# Altium schematic sheet Sheet2.SchDoc
size A3; SheetNumber: 1; SheetTotal: 1
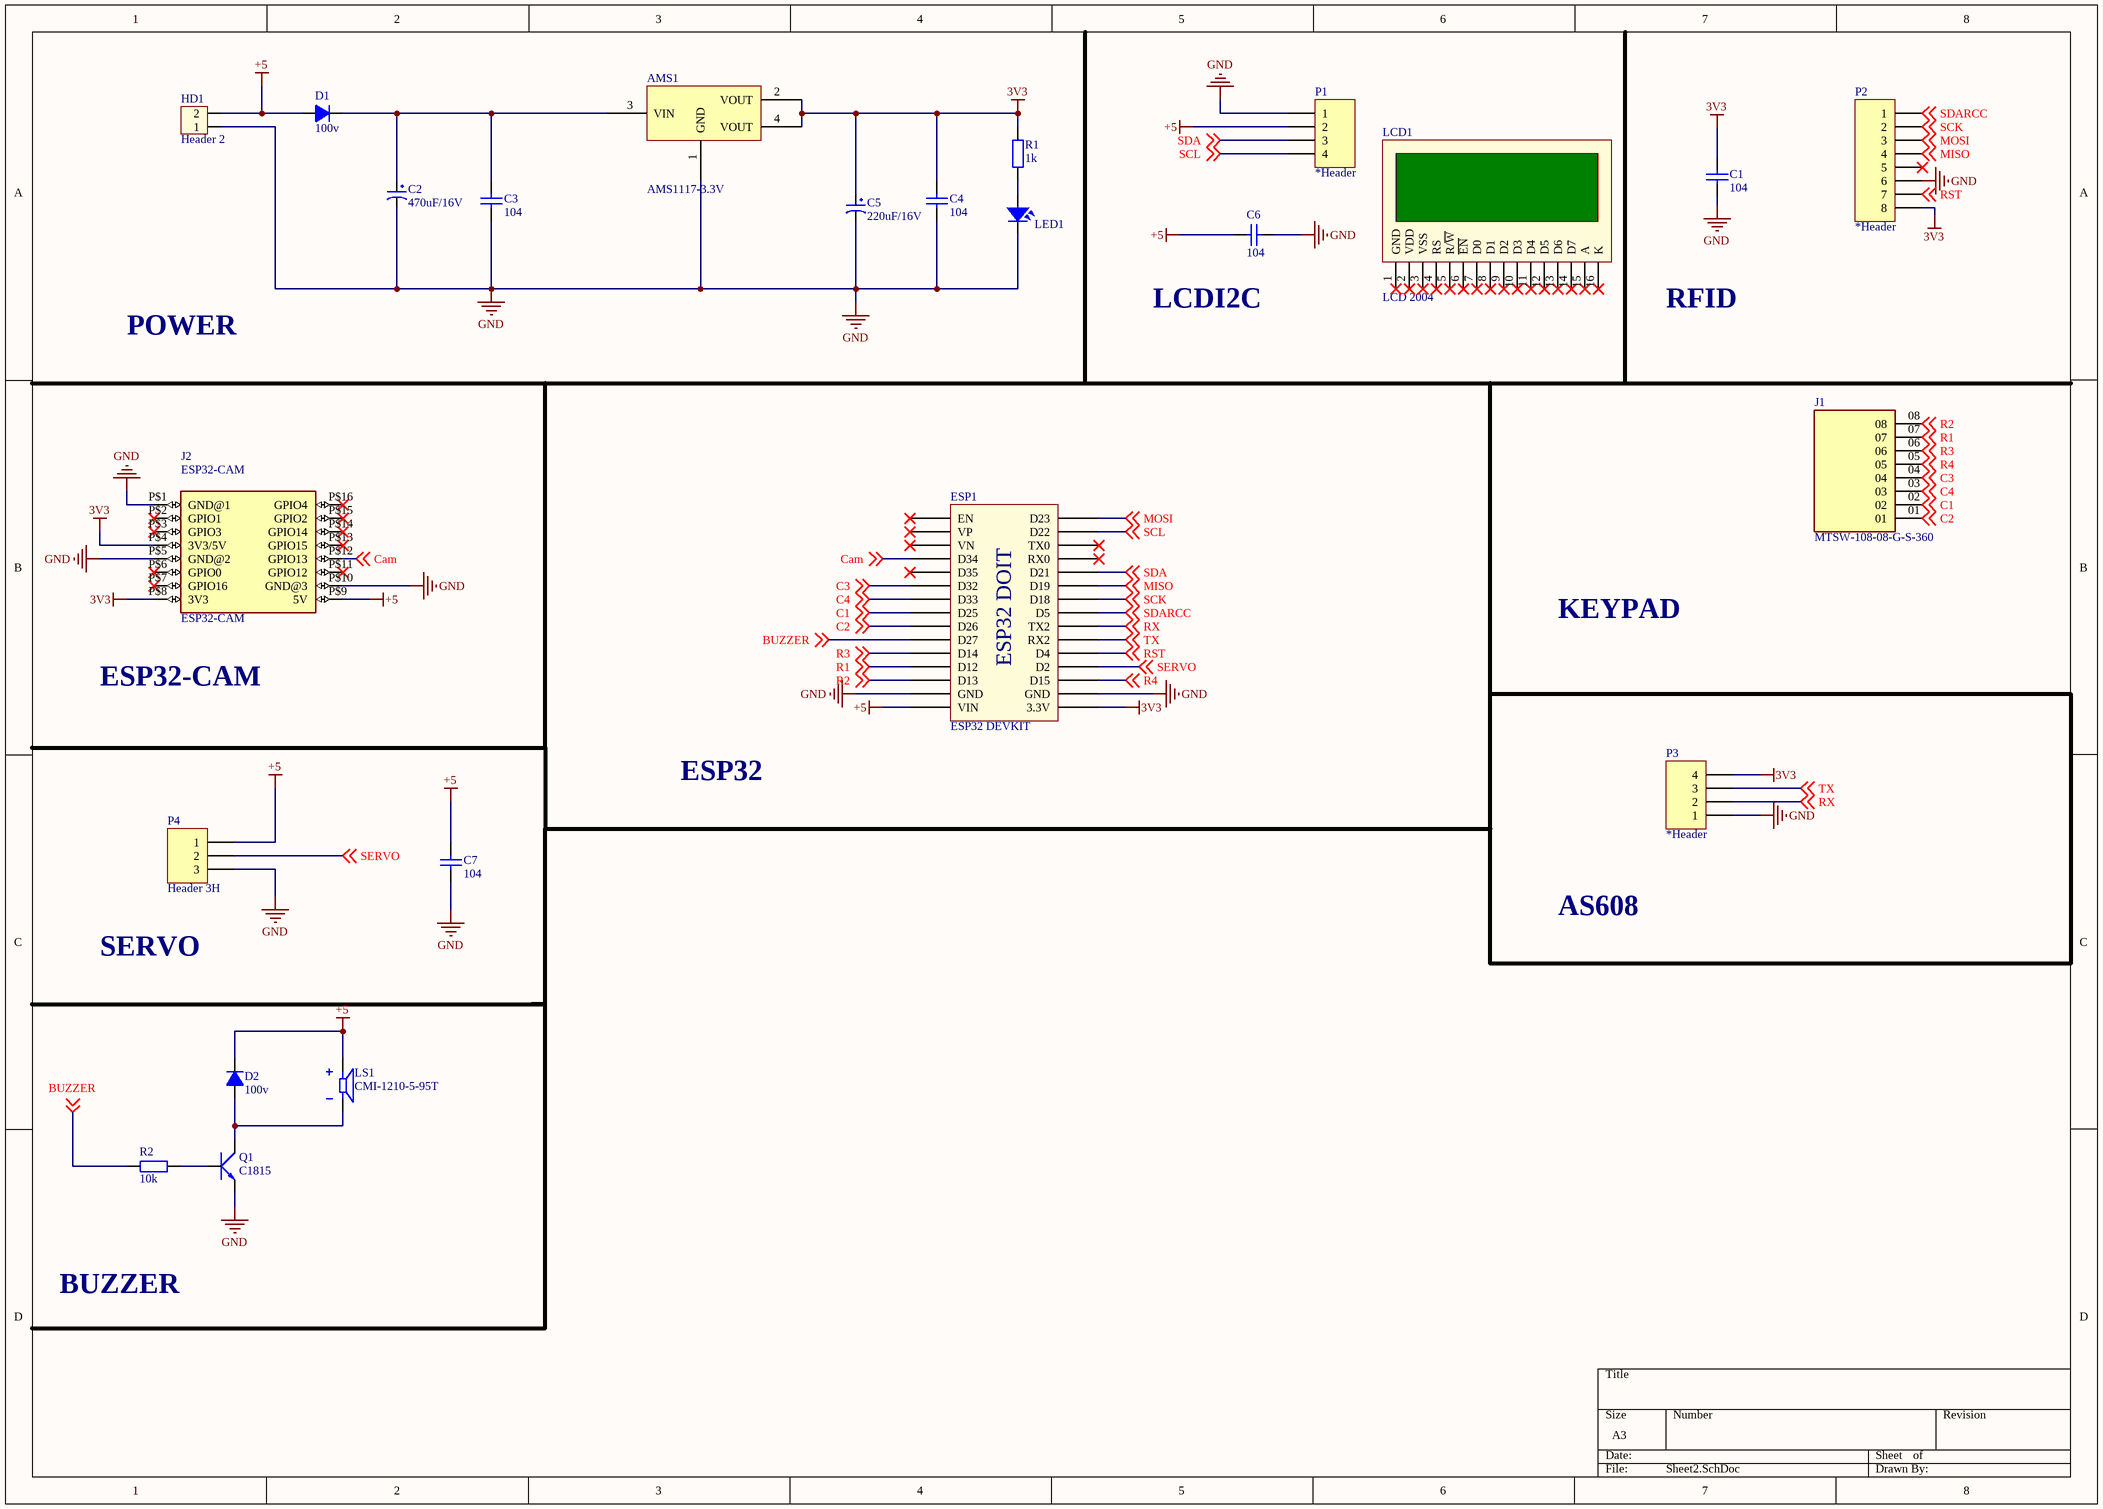
[diagram p0: Sheet2.SchDoc]

## Parts
AMS1  AMS1117-3.3V  [SOT223]
C1  104  [tu gom]
C2  470uF/16V  [CP1/2]
C3  104  [tu gom]
C4  104  [tu gom]
C5  220uF/16V  [CP1/2]
C6  104  [tu gom]
C7  104  [tu gom]
D1  100v  [DIODE 1A]
D2  100v  [DIODE 1A]
ESP1  ESP32 DEVKIT  [ESP32 WROOM 32 KIT]
HD1  Header 2  [HED2]
J1  MTSW-108-08-G-S-360  [SAMTEC_MTSW-108-08-G-S-360]
J2  ESP32-CAM  [ESP32-CAM]
LCD1  LCD 2004  [LCD 2004]
LED1  LED  [LED-5-RED]  (value not drawn)
LS1  CMI-1210-5-95T  [XDCR_CMI-1210-5-95T]
P1  *Header  [HDR1X4]
P2  *Header  [HDR1X8H]
P3  *Header  [HDR1X4]
P4  Header 3H  [HDR1X3H]
Q1  C1815  [TO92]
R1  1k  [tro vach 1/4w]
R2  10k  [tro vach 1/4w]

## Nets
3V3: AMS1.2(VOUT) AMS1.4(VOUT) C1.1 C4.1 C5.1 ESP1.16(3.3V) J2.P$4(3V3/5V) J2.P$8(3V3) P2.8 P3.4 R1.2
+5: C6.1 C7.1 D1.1(A) D2.2(K) ESP1.15(VIN) HD1.2 J2.P$9(5V) LS1.P P1.2 P4.1
GND: AMS1.1(GND) C1.2 C2.2 C3.2 C4.2 C5.2 C6.2 C7.2 ESP1.14(GND) ESP1.17(GND) HD1.1 J2.P$1(GND@1) J2.P$5(GND@2) J2.P$10(GND@3) LED1.2 P1.1 P2.6 P3.1 P4.3 Q1.1(E)
BUZZER: ESP1.10(D27) R2.1 ; off-sheet BUZZER
C1: ESP1.8(D25) J1.02 ; off-sheet C1
C2: ESP1.9(D26) J1.01 ; off-sheet C2
C3: ESP1.6(D32) J1.04 ; off-sheet C3
C4: ESP1.7(D33) J1.03 ; off-sheet C4
Cam: ESP1.4(D34) J2.P$12(GPIO13) ; off-sheet Cam
MISO: ESP1.25(D19) P2.4 ; off-sheet MISO
MOSI: ESP1.30(D23) P2.3 ; off-sheet MOSI
R1: ESP1.12(D12) J1.07 ; off-sheet R1
R2: ESP1.13(D13) J1.08 ; off-sheet R2
R3: ESP1.11(D14) J1.06 ; off-sheet R3
R4: ESP1.18(D15) J1.05 ; off-sheet R4
RST: ESP1.20(D4) P2.7 ; off-sheet RST
RX: ESP1.22(TX2) P3.2 ; off-sheet RX
SCK: ESP1.24(D18) P2.2 ; off-sheet SCK
SCL: ESP1.29(D22) P1.4 ; off-sheet SCL
SDA: ESP1.26(D21) P1.3 ; off-sheet SDA
SDARCC: ESP1.23(D5) P2.1 ; off-sheet SDARCC
SERVO: ESP1.19(D2) P4.2 ; off-sheet SERVO
TX: ESP1.21(RX2) P3.3 ; off-sheet TX
NetAMS1_3: AMS1.3(VIN) C2.1 C3.1 D1.2(K)
NetD2_1: D2.1(A) LS1.N Q1.2(C)
NetLED1_1: LED1.1 R1.1
NetQ1_3: Q1.3(B) R2.2

Not connected (* = marked no-connect by the designer): ESP1 1(EN)* 2(VP)* 3(VN)* 5(D35)* 27(RX0)* 28(TX0)*; J2 P$2(GPIO1)* P$3(GPIO3)* P$6(GPIO0)* P$7(GPIO16)* P$11(GPIO12)* P$13(GPIO15)* P$14(GPIO14)* P$15(GPIO2)* P$16(GPIO4)*; LCD1 1(GND)* 2(VDD)* 3(VSS)* 4(RS)* 5(R/~{W})* 6(~{EN})* 7(D0)* 8(D1)* 9(D2)* 10(D3)* 11(D4)* 12(D5)* 13(D6)* 14(D7)* 15(A)* 16(K)*; P2 5*

## Notes on the sheet
- (near C6) LCDI2C
- RFID
- POWER
- KEYPAD
- ESP32-CAM
- ESP32
- AS608
- SERVO
- BUZZER
- (in symbol ESP32 WROOM 32 KIT) ESP32 DOIT

## Library data of the parts
AMS1 = AMS1117 SMD: Dán; Value: AMS1117-3.3V SOT223; Don_Vi: Con; Ma_Hang: MH000596; Ghi_Chu: *; Kieu_Chan: *; Chung_Loai: Dán
C1 = Tu gom 100 50V: Cắm; Don_Vi: Con; So_Chan: 2; Ten_Linh_Kien: Tụ gốm 100 10pF 50V; Ma_Hang: MH004765; Chung_Loai: Cắm; Kieu_Chan: *
C2 C5 = CP1: Cap P  0,1uF < 22uF , 16 - 50V; Value: 10uF/50V; Description 1: 10 => 220uF/6,3V/10V - 10uF => 100uF/16V; Description 2: 0,1uF => 33uF/50V - 10uF => 22uF/63V; Description 3: 0,47uF => 10uF/100V
C3 C4 C6 C7 = Tu gom 104 50V: Cắm; So_Chan: 2; Ten_Linh_Kien: Tụ gốm 104 100nF 50V; Don_Vi: Con; Ma_Hang: MH004761; Chung_Loai: Cắm; Kieu_Chan: *
D1 D2 = Diode 1N4007: Cắm; Ten_Linh_Kien: Diode 1N4007 1A (DIP); Don_Vi: Con; Ma_Hang: MH001063; Ghi Chu: *; Kieu_Chan: *; Chung_Loai: Cắm
ESP1 = ESP32 WROOM 32 KIT
HD1 = Header 2: Header 2 (Green); Value: Header 2
J2 = ESP32-CAM: ESP32 ESP32 Transceiver; 802.11 a/b/g/n (Wi-Fi, WiFi, WLAN), BluetoothÂ® Smart 4.x Low Energy (BLE) Evaluation Board; MF: AI-Thinker; SnapEDA_Link: https://www.snapeda.com/parts/ESP32-CAM/AI-Thinker/view-part/?ref=snap; Package: None; Value: *; MP: ESP32-CAM; Check_prices: https://www.snapeda.com/parts/ESP32-CAM/AI-Thinker/view-part/?ref=eda
LCD1 = LCD 2004 5V: LCD 2004 5V Xanh Dương; Ten: LCD 2004 Xanh Dương; Ma_Hang: WVEZ; CHIP: HD44780; Don Vi Mua: Nshop
LED1 = LED: LED Single colour Green and Red; Value: LED 3 ly Single Colour
LS1 = CMI-1210-5-95T: 12 mm, 5 Vdc, 98 dB, Through Hole, Magnetic Audio Indicator Buzzer; MF: Same Sky; SnapEDA_Link: https://www.snapeda.com/parts/CMI-1210-5-95T/Same+Sky/view-part/?ref=snap; Package: None; Value: *; MP: CMI-1210-5-95T; Check_prices: https://www.snapeda.com/parts/CMI-1210-5-95T/Same+Sky/view-part/?ref=eda
P1 P3 = Header 4: Header, 4-Pin, Right Angle; LatestRevisionDate: 17-Jul-2002; LatestRevisionNote: Re-released for DXP Platform.; Publisher: Altium Limited
P2 = Header 8H: Header, 8-Pin, Right Angle; LatestRevisionDate: 17-Jul-2002; LatestRevisionNote: Re-released for DXP Platform.; Publisher: Altium Limited
P4 = Header 3H: Header, 3-Pin, Right Angle; LatestRevisionDate: 17-Jul-2002; LatestRevisionNote: Re-released for DXP Platform.; Publisher: Altium Limited
Q1 = C1815: NPN transistor; Value: C9014
R1 = Tro Vach 1/4W 1% 1.2R: Cắm; Don_Vi: Con; So_Chan: 2; Ten_Linh_Kien: Trở Vạch 1/4W 1% 1.2R; Ma_Hang: MH006341; Chung_Loai: Cắm; Kieu_Chan: *
R2 = Tro Vach 1/4W 5% 10k: Căm; Chung_Loai: Cắm; Don_Vi: Con; So_Chan: 2; Ten_Linh_Kien: Trở Vạch 1/4w 5% 10K; Ma_Hang: MH007354; Kieu_Chan: *
J1 = MTSW-108-08-G-S-360: Price: None; MP: MTSW-108-08-G-S-360; Package: None; Availability: Unavailable; Value: *